# Altium schematic sheet PWR_SW.SchDoc
size A4; SheetNumber: 14; SheetTotal: 17
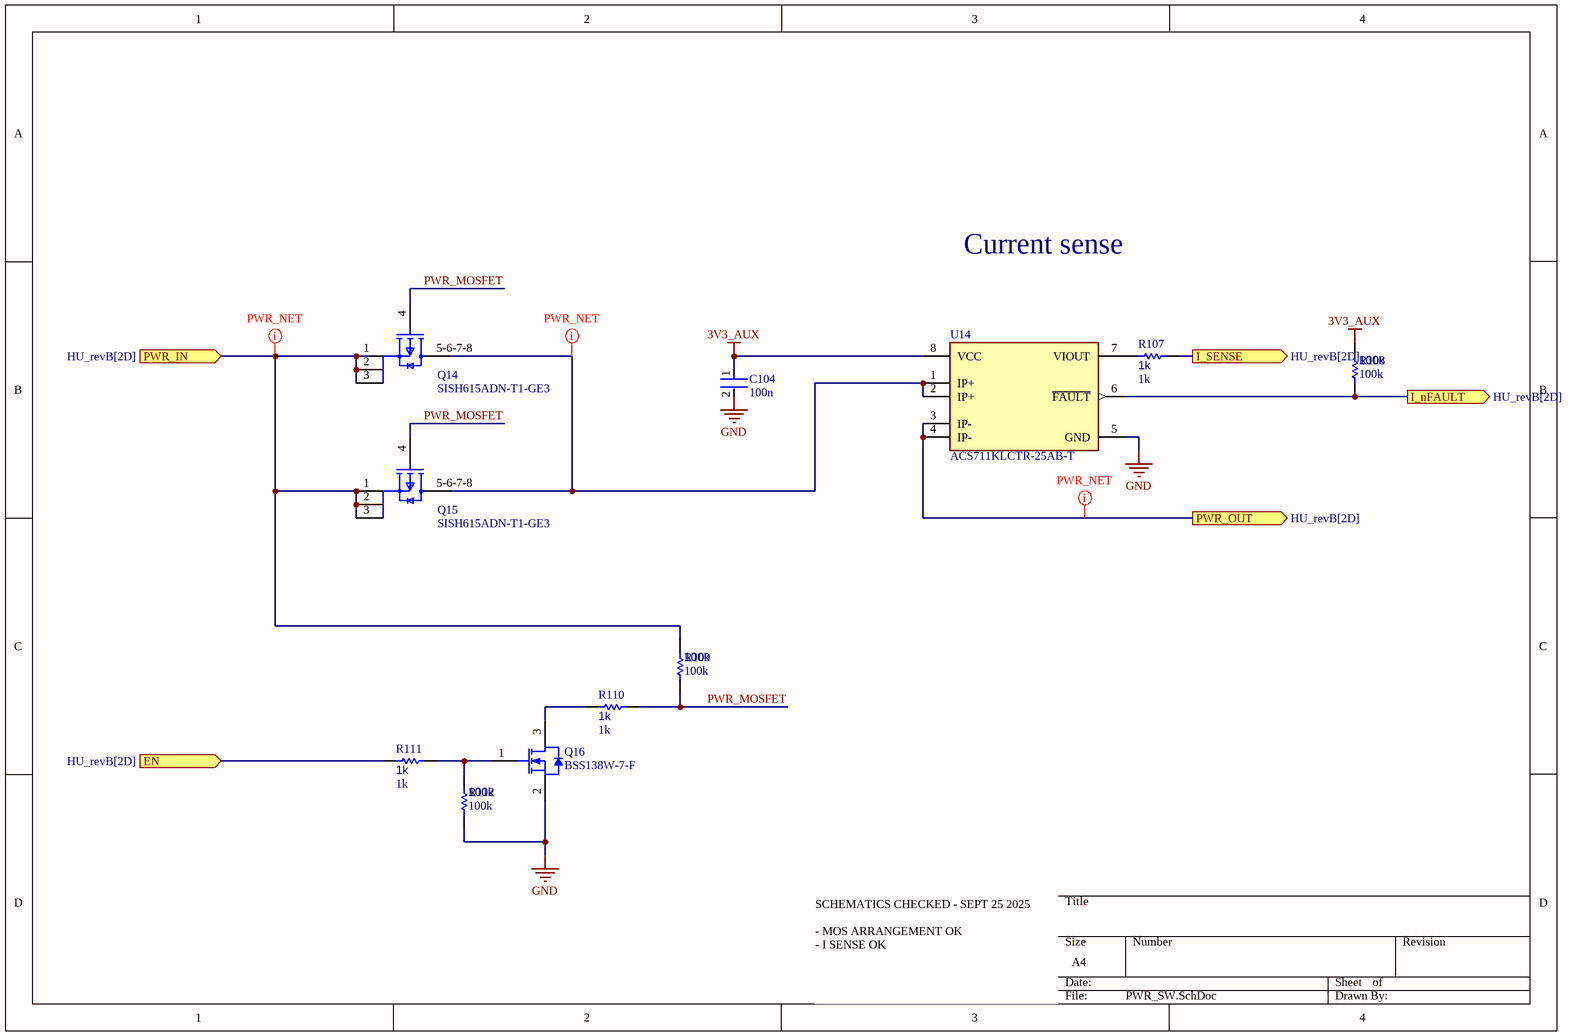
[diagram p0: PWR_SW.SchDoc]

## Parts
C104  100n  [FP-0402-L_1_0_0_05-W_0_5-IPC_A]
Q14  SISH615ADN-T1-GE3  [SISH615ADN-T1-GE3-Footprint-1]
Q15  SISH615ADN-T1-GE3  [SISH615ADN-T1-GE3-Footprint-1]
Q16  BSS138W-7-F  [DIOD-SOT323-3_V]
R107  1k  [R0603B]
R108  100k  [R0603B]
R109  100k  [R0603B]
R110  1k  [R0603B]
R111  1k  [R0603B]
R112  100k  [R0603B]
U14  ACS711KLCTR-25AB-T  [FP-LC-8-IPC_A]

## Ports
EN (in, see HU_revB[2D]), I_nFAULT (out, see HU_revB[2D]), I_SENSE (out, see HU_revB[2D]), PWR_IN (in, see HU_revB[2D]), PWR_OUT (out, see HU_revB[2D])

## Nets
3V3_AUX: C104.1 R108.2 U14.8(VCC)
GND: C104.2 Q16.2(S) R112.1 U14.5(GND)
EN: R111.1 ; port EN
I_nFAULT: R108.1 U14.6(~{FAULT}) ; port I_nFAULT
I_SENSE: R107.1 ; port I_SENSE
PWR_IN: Q14.1(S) Q14.2(S) Q14.3(S) Q15.1(S) Q15.2(S) Q15.3(S) R109.2 ; port PWR_IN
PWR_MOSFET: Q14.4(G) Q15.4(G) R109.1 R110.2
PWR_OUT: U14.3(IP-) U14.4(IP-) ; port PWR_OUT
NetQ14_5-6-7-8: Q14.5-6-7-8(D) Q15.5-6-7-8(D) U14.1(IP+) U14.2(IP+)
NetQ16_1: Q16.1(G) R111.2 R112.2
NetQ16_3: Q16.3(D) R110.1
NetR107_2: R107.2 U14.7(VIOUT)

## Layout directives
net class PWR: NetQ14_5-6-7-8, PWR_IN, PWR_OUT

## Notes on the sheet
- Current sense
- SCHEMATICS CHECKED - SEPT 25 2025
  - MOS ARRANGEMENT OK
  - I SENSE OK

## Library data of the parts
C104 = CMP-001-00058-1: LARGE PADS, 0402 CAP, CHANGE COMMENT TO MATCH REAL P/N; Capacitor Type: Ceramic; Min Operating Temperature: -55°C; Mounting Technology: Surface Mount; Pins: 2; Case/Package: 0402; RoHS Compliant: Yes; Max Operating Temperature: 85°C
Q14 Q15 = CMP-013-00018-2: Trans MOSFET P-CH 20V 22.1A 8-Pin PowerPAK 1212 EP T/R; Source: SISH615ADN-T1-GE3.SchLib; Design Item ID: CMP-013-00036-4; Component Type: Standard; Pins: 5
Q16 = CMP-2000-05968-1: N-Channel Enhancement Mode Mosfet, 50 V, 200 mA, -55 to 150 degC, 6-Pin SOT-323, RoHS, Tape and Reel; Typical Turn-Off Delay Time: 20ns; Number of Channels: 1Channel; Type: EnhancementModeFieldEffectTransistor; Brand: DiodesIncorporated; Vds - Drain-Source Breakdown Voltage: 75V; Vgs - Gate-Source Voltage: 20V; Rds On - Drain-Source Resistance: 1.4Ohms; Transistor Type: 1N-Channel; Configuration: Single; Unit Weight: 0.000212oz; Pd - Power Dissipation: 200mW; Id - Continuous Drain Current: 200mA; Forward Transconductance - Min: 0.1S; Manufacturer URL: http://www.diodes.com/; Series: BSS138; Package Description: 3-Pin Small Outline Transistor, Body 2 x 1.25 mm, Pitch 0.65 mm; Mounting Technology: SurfaceMount; Product Category: MOSFET; RoHS: True; Maximum Operating Temperature: +150C; Height: 1mm; Length: 2.2mm; Technology: Si; Width: 1.35mm; Datasheet URL: http://www.diodes.com/_files/datasheets/ds30206.pdf; Manufacturer: DiodesIncorporated; Package / Case: SOT-323-3; Typical Turn-On Delay Time: 20ns; Transistor Polarity: N-Channel; Factory Pack Quantity: 3000; Packaging: Reel; Product: MOSFETSmallSignal; Datasheet Version: Rev. 11-2, 09/2013; Package Reference: SOT323; Minimum Operating Temperature: -55C; Mounting Style: SMD/SMT; Channel Mode: Enhancement
R107-R112 = CMP-009-00002-14: Resistor
  R107 R110 R111: Value: 1k
  R108 R109 R112: Value: 100k
U14 = CMP-1557-00015-2: SENSOR CURRENT HALL 25A AC/DC; Bandwidth: 100kHz; Min Supply Voltage: 3V; Polarity: Bidirectional; Max Supply Voltage: 5.5V; Max Supply Current: 5.5mA; Number of Channels: 1; Quiescent Current: 4mA; Sensitivity: 55mV/A; Accuracy: 4%; Linearity: 1%; Operating Supply Voltage: 3.3V; Response Time: 4.6us; Case/Package: SOIC; Min Operating Temperature: -40°C; RoHS Compliant: Yes; Length: 4.9mm; Package Quantity: 1; Number of Pins: 8; Width: 3.9mm; REACH SVHC: No SVHC; -3db Bandwidth: 100kHz; Series: -; Packaging: Tape and Reel; Max Operating Temperature: 125°C; Current Sensing: 25A; Height: 1.5mm; Frequency: 100kHz